# Altium schematic sheet Interface.SchDoc
size A3; Author: Ali Zoubir; Organization: ETML-ES; Address1: Avenue Recordon 1; Address2: 1004 Lausanne; Address3: Switzerland; Revision: 2221; SheetNumber: 4; SheetTotal: 6; Version: V0
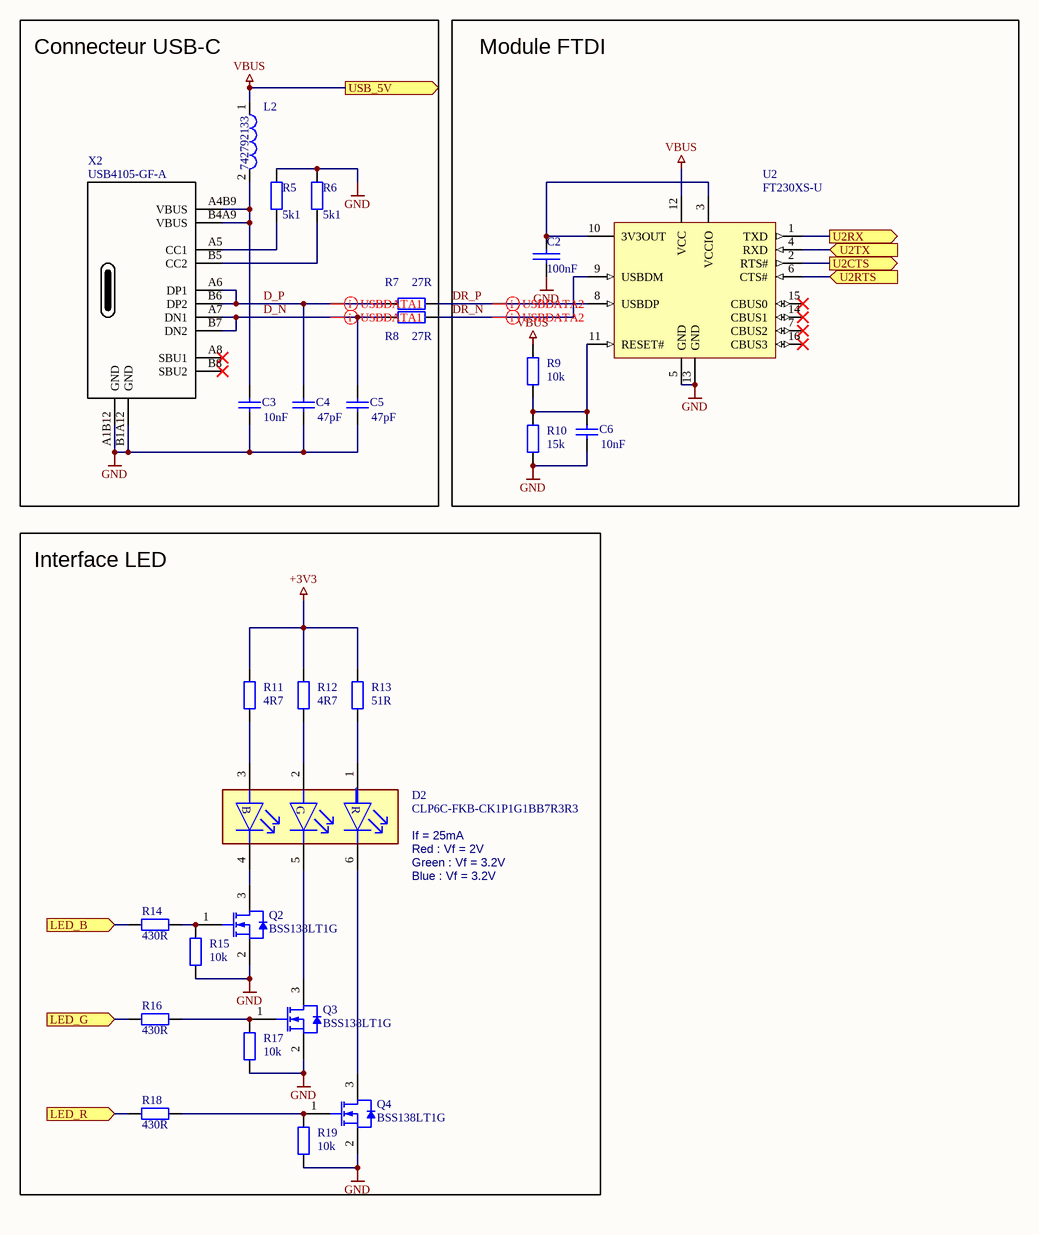
[diagram p0: Interface.SchDoc]

## Parts
C2  100nF  [6-0805_L]
C3  10nF  [6-0805_L]
C4  47pF  [6-0805_L]
C5  47pF  [6-0805_L]
C6  10nF  [6-0805_L]
D2  CLP6C-FKB-CK1P1G1BB7R3R3  [FP-CLP6C-FKB-CK1P1G1BB7R3-MFG]
L2  742792133  [SMD-1206]
Q2  BSS138LT1G  [ONSC-SOT-23-3-318-08_V]
Q3  BSS138LT1G  [ONSC-SOT-23-3-318-08_V]
Q4  BSS138LT1G  [ONSC-SOT-23-3-318-08_V]
R5  5k1  [6-0805_L]
R6  5k1  [6-0805_L]
R7  27R  [6-0805_L]
R8  27R  [6-0805_L]
R9  10k  [6-0805_L]
R10  15k  [6-0805_L]
R11  4R7  [6-0805_L]
R12  4R7  [6-0805_L]
R13  51R  [6-0805_L]
R14  430R  [6-0805_L]
R15  10k  [6-0805_L]
R16  430R  [6-0805_L]
R17  10k  [6-0805_L]
R18  430R  [6-0805_L]
R19  10k  [6-0805_L]
U2  FT230XS-U  [SSOP-16_N]
X2  USB4105-GF-A  [GCT_USB4105-GF-A]

## Blocks framed on the sheet
Connecteur USB-C: C3-C5 L2 R5-R8 X2
Module FTDI: C2 C6 R9 R10 U2
Interface LED: D2 Q2-Q4 R11-R19

## Ports
LED_B (in), LED_G (in), LED_R (in), U2CTS (out), U2RTS (in), U2RX (out), U2TX (in), USB_5V (out)

## Nets
+3V3: R11.2 R12.2 R13.2
GND: C2.2 C3.1 C4.1 C5.1 C6.1 Q2.2(S) Q3.2(S) Q4.2(S) R5.2 R6.2 R10.1 R15.1 R17.1 R19.1 U2.5(GND) U2.13(GND) X2.A1B12(GND) X2.B1A12(GND)
VBUS: L2.1 R9.2 U2.12(VCC) ; port USB_5V
D_N: C5.2 R8.1 X2.A7(DN1) X2.B7(DN2)
D_P: C4.2 R7.1 X2.A6(DP1) X2.B6(DP2)
DR_N: R8.2 U2.9(USBDM)
DR_P: R7.2 U2.8(USBDP)
LED_B: R14.2 ; port LED_B
LED_G: R16.2 ; port LED_G
LED_R: R18.2 ; port LED_R
U2CTS: U2.2(RTS#) ; port U2CTS
U2RTS: U2.6(CTS#) ; port U2RTS
U2RX: U2.1(TXD) ; port U2RX
U2TX: U2.4(RXD) ; port U2TX
NetC2_1: C2.1 U2.3(VCCIO) U2.10(3V3OUT)
NetC3_2: C3.2 L2.2 X2.A4B9(VBUS) X2.B4A9(VBUS)
NetC6_2: C6.2 R9.1 R10.2 U2.11(RESET#)
NetD2_1: D2.1(RED_A) R13.1
NetD2_2: D2.2(GREEN_A) R12.1
NetD2_3: D2.3(BLUE_A) R11.1
NetD2_4: D2.4(BLUE_C) Q2.3(D)
NetD2_5: D2.5(GREEN_C) Q3.3(D)
NetD2_6: D2.6(RED_C) Q4.3(D)
NetQ2_1: Q2.1(G) R14.1 R15.2
NetQ3_1: Q3.1(G) R16.1 R17.2
NetQ4_1: Q4.1(G) R18.1 R19.2
NetR5_1: R5.1 X2.A5(CC1)
NetR6_1: R6.1 X2.B5(CC2)

Not connected (* = marked no-connect by the designer): U2 7(CBUS2)* 14(CBUS1)* 15(CBUS0)* 16(CBUS3)*; X2 A8(SBU1)* B8(SBU2)*

## Layout directives
differential pair: D_N, D_P, DR_N, DR_P

## Notes on the sheet
- If = 25mA
- Red : Vf = 2V
- Green : Vf = 3.2V
- Blue : Vf = 3.2V
- Fichier :
- a
- Date :
- Heure :
- Version :
- Auteur :
- Modif.
- b
- c
- d
- Projet :
- No :
- Nb feuilles
- Feuille n°
- Chemin :
- (in symbol CMP-13977-000020-2) B; G; R

## Library data of the parts
C2 = C: SDTSourceLibName: C:\WINDOWS\TEMP\DA.LIB; PCB Footprint: RC0805
C3-C6 = Cap: Capacitor; Published: 8-Jun-2000; LatestRevisionDate: 17-Jul-2002; LatestRevisionNote: Re-released for DXP Platform.; PackageReference: RAD-0.3; Publisher: Altium Limited; PackageDescription: Radial Cap, Thru-Hole; 2 Leads; 0.3 in Pin Spacing
  C3 C6: Value: 10nF
  C4 C5: Value: 47pF
D2 = CMP-13977-000020-2: LED RGB DIFFUSED 6PLCC SMD; Color: Blue; Luminous Intensity: 420mcd; Lens Style: Flat; Forward Voltage: 3.2V; Test Current: 20mA; Viewing Angle: 120°; Number of LEDs: 3; Dominant Wavelength: 470nm; Reverse Voltage: 5V; Lens Color: White; Lens Transparency: Diffused; Depth: 5mm; Case/Package: SMD/SMT; Number of Pins: 6; RoHS Compliant: Yes; Mount: Surface Mount; Packaging: Tape and Reel; Min Operating Temperature: -40°C; Height: 2.6mm; Package Quantity: 900; Width: 5mm; Forward Current: 20mA; Series: -; Number of Elements: 3; Length: 6mm; Max Operating Temperature: 100°C
L2 = CMP-0220-00010-1: SMD EMI Suppression Ferrite Bead WE-CBF, Z = 600 Ohm; Impedance: 600 Ohm; ComponentLink1Description: Manufacturer Link; DatasheetVersion: ver 2, Aug-2007; ComponentLink1URL: http://www.we-online.com; PackageDescription: Chip Inductor, 2-Leads, Body 3.2 x 1.6 mm; ComponentLink2URL: http://www.we-online.de/katalog/media/pdf/742792133.pdf; PackageVersion: 2007; PackageReference: SMD-1206; ComponentLink2Description: Datasheet
Q2-Q4 = CMP-1058-00767-1: Power MOSFET, 200 mA, 50 V, N-Channel, 3-Pin SOT-23, Pb-Free, Tape and Reel; Manufacturer: On Semiconductor; PD Max (W): 0.225; Coss Typ (pF): 12; V(BR)DSS Min (V): 50; VGS Max (V): 20; Channel Polarity: N Channel; Configuration: Single; VGS(th) Max (V): 1.5; Ciss Typ (pF): 40; Crss Typ (pF): 3.5; ID Max (A): 0.2; ComponentLink3Description: Package Specification; PackageDescription: 3-Pin Small Outline Transistor, Body 2.92 x 1.3 mm, Pitch 0.95 mm; PackageReference: SOT-23-3-318-08; RoHS: Pb-Free; Mounting Technology: Surface Mount; ComponentLink1Description: Manufacturer URL; ComponentLink2URL: http://www.onsemi.com/pub_link/Collateral/BSS138LT1-D.PDF; ComponentLink2Description: Datasheet; Packing: Tape and Reel; PackageVersion: Rev. AP, 11/2009; PartNumber: BSS138LT1G; Package Type: SOT-23-3; ComponentLink1URL: http://www.onsemi.com/; DatasheetVersion: Rev. 8; ComponentLink3URL: http://www.onsemi.cn/pub_link/Collateral/318-08.PDF
R5-R19 = Res2: Res 0805; Published: 8-Jun-2000; LatestRevisionDate: 17-Jul-2002; LatestRevisionNote: Re-released for DXP Platform.; PackageReference: AXIAL-0.4; Publisher: Altium Limited; PackageDescription: Axial Device, Thru-Hole; 2 Leads; 0.4 in Pin Spacing
  R5 R6: Value: 5k1
  R7 R8: Value: 27R
  R9 R15 R17 R19: Value: 10k
  R10: Value: 15k
  R11 R12: Value: 4R7
  R13: Value: 51R
  R14 R16 R18: Value: 430R
U2 = CMP-0248-00025-2: USB to Basic UART Interface Chip, UHCI/OHCI/EHCI Compatible, USB 2.0 Compatible, -40 to +85 degC, 16-Pin SSOP, Pb-Free, Tube; Manufacturer: FTDI; PackageDescription: 16-Pin Small Outline Package, 8.6 x 3.9 mm Body, 0.635 mm Pitch; ComponentLink2URL: http://www.ftdichip.com/Support/Documents/DataSheets/ICs/DS_FT230X.pdf; ComponentLink3URL: www.ftdichip.com/Products/ICs/FT230X.html; PartNumber: FT230XS-U; RevisionNote: DatasheetVersion updated to 1.2 Feb-2013; PackageVersion: Feb-13; ComponentLink2Description: Datasheet; Code_JEDEC: MO-137-AB; DatasheetVersion: ver 1.2, Feb-2013; ComponentLink1URL: http://www.ftdichip.com/; PackageReference: SSOP-16; ComponentLink1Description: Manufacturer URL; ComponentLink3Description: FT230X Product Page
X2 = USB-C Type 2.0: USB4105-GF-A USB connector; ComponentLink1Description: LCSC  C319148; ComponentLink1URL: https://lcsc.com/product-detail/USB-Connectors_XKB-Connectivity-U262-161N-4BVC11_C319148.html; Supplier 1: LCSC; Supplier Part Number 1: C319148